# Altium schematic sheet Memory.SchDoc
size A4; PageSetup: Record=PageOptions|CenterHorizontal=True|CenterVertical=True|PrintScale=0.96|XCorrection=1.00|YCorrection=1.00|PrintKind=2|BorderSize=5000000|LeftOffset=0|BottomOffset=0|Orientation=2|PaperLength=1000|PaperWidth=1000|Scale=100|PaperSource=7|PrintQuality=-4|MediaType=1|DitherType=10|PaperKind=A4|PrintScaleMode=1
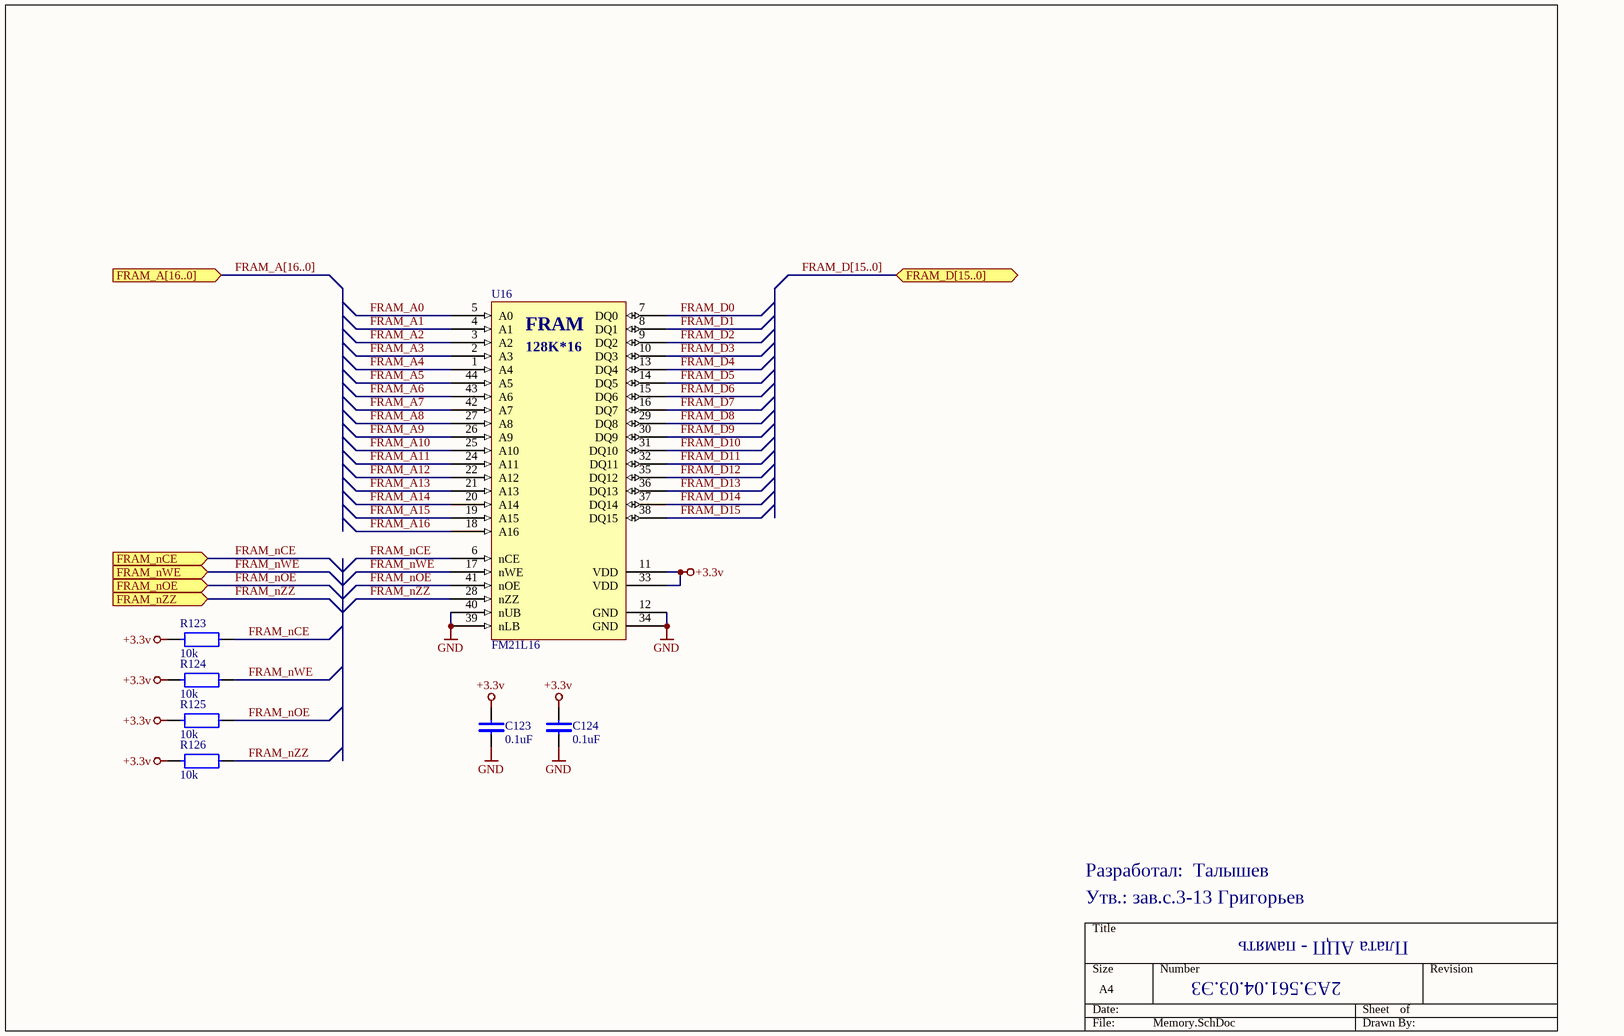
[diagram p0: Memory.SchDoc]

## Parts
C123  0.1uF  [0603]
C124  0.1uF  [0603]
R123  10k  [0603]
R124  10k  [0603]
R125  10k  [0603]
R126  10k  [0603]
U16  FM21L16  [TSOP-II-44]

## Ports
FRAM_A[16..0] (in), FRAM_D[15..0] (bidir), FRAM_nCE (in), FRAM_nOE (in), FRAM_nWE (in), FRAM_nZZ (in)

## Nets
+3.3v: C123.2 C124.2 R123.2 R124.2 R125.2 R126.2 U16.11(VDD) U16.33(VDD)
GND: C123.1 C124.1 U16.12(GND) U16.34(GND) U16.39(nLB) U16.40(nUB)
FRAM_A0: U16.5(A0)
FRAM_A1: U16.4(A1)
FRAM_A2: U16.3(A2)
FRAM_A3: U16.2(A3)
FRAM_A4: U16.1(A4)
FRAM_A5: U16.44(A5)
FRAM_A6: U16.43(A6)
FRAM_A7: U16.42(A7)
FRAM_A8: U16.27(A8)
FRAM_A9: U16.26(A9)
FRAM_A10: U16.25(A10)
FRAM_A11: U16.24(A11)
FRAM_A12: U16.22(A12)
FRAM_A13: U16.21(A13)
FRAM_A14: U16.20(A14)
FRAM_A15: U16.19(A15)
FRAM_A16: U16.18(A16)
FRAM_D0: U16.7(DQ0)
FRAM_D1: U16.8(DQ1)
FRAM_D2: U16.9(DQ2)
FRAM_D3: U16.10(DQ3)
FRAM_D4: U16.13(DQ4)
FRAM_D5: U16.14(DQ5)
FRAM_D6: U16.15(DQ6)
FRAM_D7: U16.16(DQ7)
FRAM_D8: U16.29(DQ8)
FRAM_D9: U16.30(DQ9)
FRAM_D10: U16.31(DQ10)
FRAM_D11: U16.32(DQ11)
FRAM_D12: U16.35(DQ12)
FRAM_D13: U16.36(DQ13)
FRAM_D14: U16.37(DQ14)
FRAM_D15: U16.38(DQ15)
FRAM_nCE: R123.1 U16.6(nCE) ; port FRAM_nCE
FRAM_nOE: R125.1 U16.41(nOE) ; port FRAM_nOE
FRAM_nWE: R124.1 U16.17(nWE) ; port FRAM_nWE
FRAM_nZZ: R126.1 U16.28(nZZ) ; port FRAM_nZZ

## Buses and harness runs
bus FRAM_A[16..0] = port FRAM_A[16..0]
bus FRAM_D[15..0] = port FRAM_D[15..0]

## Notes on the sheet
- Разработал:  Талышев
- Утв.: зав.с.3-13 Григорьев
- 2АЭ.561.04.03.Э3
- Плата АЦП - память
- (in symbol FM21L16) FRAM; 128K*16

## Library data of the parts
C123 C124 = C
R123-R126 = R
U16 = FM21L16: 2Mbit (128K*16) F-RAM Memory